# EAGLE schematic project (EAGLE 9.6.2)
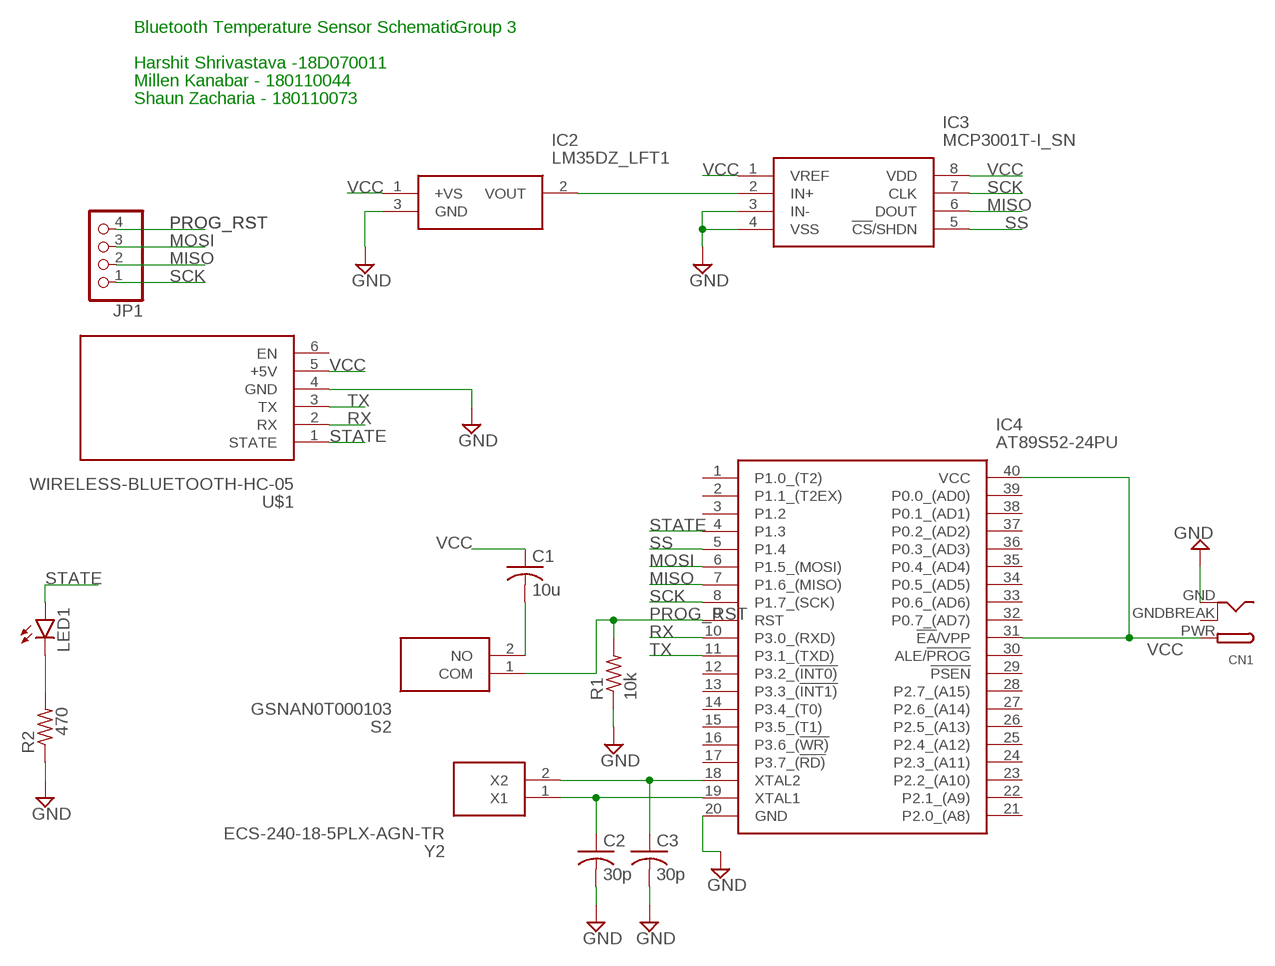
[diagram p0: schematic, sheet 1]

## Parts
C1  10u  C-US025-050X050  [C025-050X050]
C2  30p  C-US025-050X050  [C025-050X050]
C3  30p  C-US025-050X050  [C025-050X050]
CN1  DCBARRELPTH  [DCJACK_2MM_PTH]
IC2  LM35DZ_LFT1  [LP0003A]
IC3  MCP3001T-I_SN  [SOIC127P600X175-8N]
IC4  AT89S52-24PU  [DIP1556W56P254L5232H483Q40N]
JP1  PINHD-1X4  [1X04]
LED1  LED  [SMARTLED-TTW]
R1  10k  R-US_0207/10  [0207/10]
R2  470  R-US_0207/10  [0207/10]
S2  GSNAN0T000103  [GSNAN0T000103]
U$1  WIRELESS-BLUETOOTH-HC-05  [WIRELESS-BLUETOOTH-HC-05]
Y2  ECS-240-18-5PLX-AGN-TR  [ECS240185PLXAGNTR]

## Nets
GND: C2.2 C3.2 CN1.GND IC2.3(GND) IC3.3(IN-) IC3.4(VSS) IC4.20(GND) R1.1 R2.1 U$1.4(GND)
MISO: IC3.6(DOUT) IC4.7(P1.6_(MISO)) JP1.2
MOSI: IC4.6(P1.5_(MOSI)) JP1.3
N$1: C3.1 IC4.18(XTAL2) Y2.2(X2)
N$2: C2.1 IC4.19(XTAL1) Y2.1(X1)
N$3: IC2.2(VOUT) IC3.2(IN+)
N$5: C1.2 S2.2(NO)
N$6: LED1.C@1(C) R2.2
PROG_RST: IC4.9(RST) JP1.4 R1.2 S2.1(COM)
RX: IC4.10(P3.0_(RXD)) U$1.2(RX)
SCK: IC3.7(CLK) IC4.8(P1.7_(SCK)) JP1.1
SS: IC3.5(!CS!/SHDN) IC4.5(P1.4)
STATE: IC4.4(P1.3) LED1.A@1(A) U$1.1(STATE)
TX: IC4.11(P3.1_(TXD)) U$1.3(TX)
VCC: C1.1 CN1.PWR IC2.1(+VS) IC3.1(VREF) IC3.8(VDD) IC4.31(!EA!/VPP) IC4.40(VCC) U$1.5(+5V)
Unconnected: IC4.1(P1.0_(T2)) IC4.2(P1.1_(T2EX)) IC4.3(P1.2) IC4.12(P3.2_(!INT0)) IC4.13(P3.3_(!INT1)) IC4.14(P3.4_(T0)) IC4.15(P3.5_(T1)) IC4.16(P3.6_(!WR)) IC4.17(P3.7_(!RD)) IC4.21(P2.0_(A8)) IC4.22(P2.1_(A9)) IC4.23(P2.2_(A10)) IC4.24(P2.3_(A11)) IC4.25(P2.4_(A12)) IC4.26(P2.5_(A13)) IC4.27(P2.6_(A14)) IC4.28(P2.7_(A15)) IC4.29(!PSEN) IC4.30(ALE/!PROG) IC4.32(P0.7_(AD7)) IC4.33(P0.6_(AD6)) IC4.34(P0.5_(AD5)) IC4.35(P0.4_(AD4)) IC4.36(P0.3_(AD3)) IC4.37(P0.2_(AD2)) IC4.38(P0.1_(AD1)) IC4.39(P0.0_(AD0)) U$1.6(EN)

## Notes on the sheet
- Bluetooth Temperature Sensor Schematic | Group 3
- Harshit Shrivastava -18D070011
- Millen Kanabar - 180110044
- Shaun Zacharia - 180110073

## Power pins joined to a net without a drawn wire
GNDBREAK: CN1.GNDBREAK

## Library data of the parts
C1-C3 = rcl:C-US: CAPACITOR, American symbol; SPICEPREFIX: C
CN1 = adafruit:DCBARREL: 2.0mm DC Barrel Jack DCJACK_2MM_PTH - Through Hole Jack (4UConnector: 05537)
IC2 = SamacSys_Parts:LM35DZ_LFT1: +/-0.5C Temperature Sensor with Analog Output with 30V Capability Source: Datasheet <http://www.ti.com/general/docs/suppproductinfo.tsp?distId=10&gotoUrl=http://www.ti.com/lit/gpn/lm35>; DESCRIPTION: +/-0.5C Temperature Sensor with Analog Output with 30V Capability; HEIGHT: mm; MANUFACTURER_NAME: Texas Instruments; MANUFACTURER_PART_NUMBER: LM35DZ/LFT1; MOUSER_PART_NUMBER: 926-LM35DZ/LFT1; MOUSER_PRICE-STOCK: https://www.mouser.co.uk/ProductDetail/Texas-Instruments/LM35DZ-LFT1?qs=QbsRYf82W3H30AtKgrS0IA%3D%3D
IC3 = SamacSys_Parts:MCP3001T-I_SN: Analog to Digital Converters - ADC 10-bit SPI Sgl Chl IND TEMP, SOIC8 Source: Datasheet <http://www.microchip.com/mymicrochip/filehandler.aspx?ddocname=en011533>; DESCRIPTION: Analog to Digital Converters - ADC 10-bit SPI Sgl Chl IND TEMP, SOIC8; HEIGHT: 1.75mm; MANUFACTURER_NAME: Microchip; MANUFACTURER_PART_NUMBER: MCP3001T-I/SN; MOUSER_PART_NUMBER: 579-MCP3001T-I/SN; MOUSER_PRICE-STOCK: https://www.mouser.co.uk/ProductDetail/Microchip-Technology/MCP3001T-I-SN/?qs=rh436G1KrYxYH73wf1FE%252Bw%3D%3D
IC4 = AT89S52-24PU:AT89S52-24PU: MICROCHIP - AT89S52-24PU - MCU, 8BIT, 8051, 24MHZ, DIP-40 Source: Datasheet <http://www.atmel.com/images/doc1919.pdf>; DESCRIPTION: MICROCHIP - AT89S52-24PU - MCU, 8BIT, 8051, 24MHZ, DIP-40; HEIGHT: 4.826mm; MANUFACTURER_NAME: Microchip; MANUFACTURER_PART_NUMBER: AT89S52-24PU; MOUSER_PART_NUMBER: 556-A89S52-24PU; MOUSER_PRICE-STOCK: https://www.mouser.co.uk/ProductDetail/Microchip-Technology-Atmel/AT89S52-24PU?qs=8jWQYweyg6NY4trJB40Tig%3D%3D
JP1 = pinhead:PINHD-1X4: PIN HEADER
LED1 = led:LED: LED OSRAM: - CHIPLED LG R971, LG N971, LY N971, LG Q971, LY Q971, LO R971, LY R971 LH N974, LH R974 LS Q976, LO Q976, LY Q976 LO Q996 - Hyper CHIPLED LW Q18S LB Q993, LB Q99A, LB R99A - SideLED LS A670, LO A670, LY A670, LG A670, LP A670 LB A673, LV A673, LT A673, LW A673 LH A674 LY A675 LS A676, LA A676, LO A676, LY A676, LW A676 LS A679, LY A679, LG A679 - Hyper Micro SIDELED® LS Y876, LA Y876, LO Y876, LY Y876 LT Y87S - SmartLED LW L88C, LW L88S LB L89C, LB L89S, LG L890 LS L89K, LO L89K, LY L89K LS L896, LA L896, LO L896, LY L896 - TOPLED LS T670, LO T670, LY T670, LG T670, LP T670 LSG T670, LSP T670, LSY T670, LOP T670, LYG T670 LG T671, LOG T671, LSG T671 LB T673, LV T673, LT T673, LW T673 LH T674 LS T676, LA T676, LO T676, LY T676, LB T676, LH T676, LSB T676, LW T676 LB T67C, LV T67C, LT T67C, LS T67K, LO T67K, LY T67K, LW E67C LS E67B, LA E67B, LO E67B, LY E67B, LB E67C, LV E67C, LT E67C LW T67C LS T679, LY T679, LG T679 LS T770, LO T770, LY T770, LG T770, LP T770 LB T773, LV T773, LT T773, LW T773 LH T774 LS E675, LA E675, LY E675, LS T675 LS T776, LA T776, LO T776, LY T776, LB T776 LHGB T686 LT T68C, LB T68C - Hyper Mini TOPLED® LB M676 - Mini TOPLED Santana® LG M470 LS M47K, LO M47K, LY M47K Source: http://www.osram.convergy.de LUXEON: - LUMILED® LXK2-PW12-R00, LXK2-PW12-S00, LXK2-PW14-U00, LXK2-PW14-V00 LXK2-PM12-R00, LXK2-PM12-S00, LXK2-PM14-U00 LXK2-PE12-Q00, LXK2-PE12-R00, LXK2-PE12-S00, LXK2-PE14-T00, LXK2-PE14-U00 LXK2-PB12-K00, LXK2-PB12-L00, LXK2-PB12-M00, LXK2-PB14-N00, LXK2-PB14-P00, LXK2-PB14-Q00 LXK2-PR12-L00, LXK2-PR12-M00, LXK2-PR14-Q00, LXK2-PR14-R00 LXK2-PD12-Q00, LXK2-PD12-R00, LXK2-PD12-S00 LXK2-PH12-R00, LXK2-PH12-S00 LXK2-PL12-P00, LXK2-PL12-Q00, LXK2-PL12-R00 Source: www.luxeon.com KINGBRIGHT: KA-3528ASYC Source: www.kingbright.com
R1 R2 = rcl:R-US_: RESISTOR, American symbol; SPICEPREFIX: R
S2 = SamacSys_Parts:GSNAN0T000103: Tactile Switches NANOT 240 AS Source: Datasheet; DESCRIPTION: Tactile Switches NANOT 240 AS; HEIGHT: 0.55mm; MANUFACTURER_NAME: C & K COMPONENTS; MANUFACTURER_PART_NUMBER: GSNAN0T000103; MOUSER_PART_NUMBER: 611-GSNAN0T000103; MOUSER_PRICE-STOCK: https://www.mouser.co.uk/ProductDetail/CK/GSNAN0T000103?qs=bAKSY%2FctAC5rpQT3vfqNww%3D%3D
U$1 = HC-05:WIRELESS-BLUETOOTH-HC-05: Bluetooth Transceiver Module based on HC-05 board Tutorial is available here: https://arduino-info.wikispaces.com/BlueTooth-HC05-HC06-Modules-How-To Click here to find device on ebay.com <http://www.ebay.com/sch/hc-05+module+rs232>
Y2 = ECS-240-18-5PLX-AGN-TR:ECS-240-18-5PLX-AGN-TR: Crystals CRYSTAL 25.000 MHZ 18PF SMD,CSM-7X,+/-30ppm,+/-30ppm,18pF,30 Ohm,Fundamental,-40 C 85 C,HC49/US,0.449" L x 0.189" W (11.40mm x 4.80mm),0.126" (3.20mm) Source: Datasheet <https://www.arrow.com/en/products/ecs-240-18-5plx-agn-tr/ecs-international>; DESCRIPTION: Crystals CRYSTAL 25.000 MHZ 18PF SMD,CSM-7X,+/-30ppm,+/-30ppm,18pF,30 Ohm,Fundamental,-40 C 85 C,HC49/US,0.449" L x 0.189" W (11.40mm x 4.80mm),0.126" (3.20mm); HEIGHT: 3.2mm; MANUFACTURER_NAME: ECS; MANUFACTURER_PART_NUMBER: ECS-240-18-5PLX-AGN-TR; MOUSER_PART_NUMBER: 520-240-18-5PLXAGNTR; MOUSER_PRICE-STOCK: https://www.mouser.co.uk/ProductDetail/ECS/ECS-240-18-5PLX-AGN-TR?qs=PzGy0jfpSMsnFc5Itl9RxA%3D%3D